# Altium schematic sheet Sheet02.SchDoc
size A4
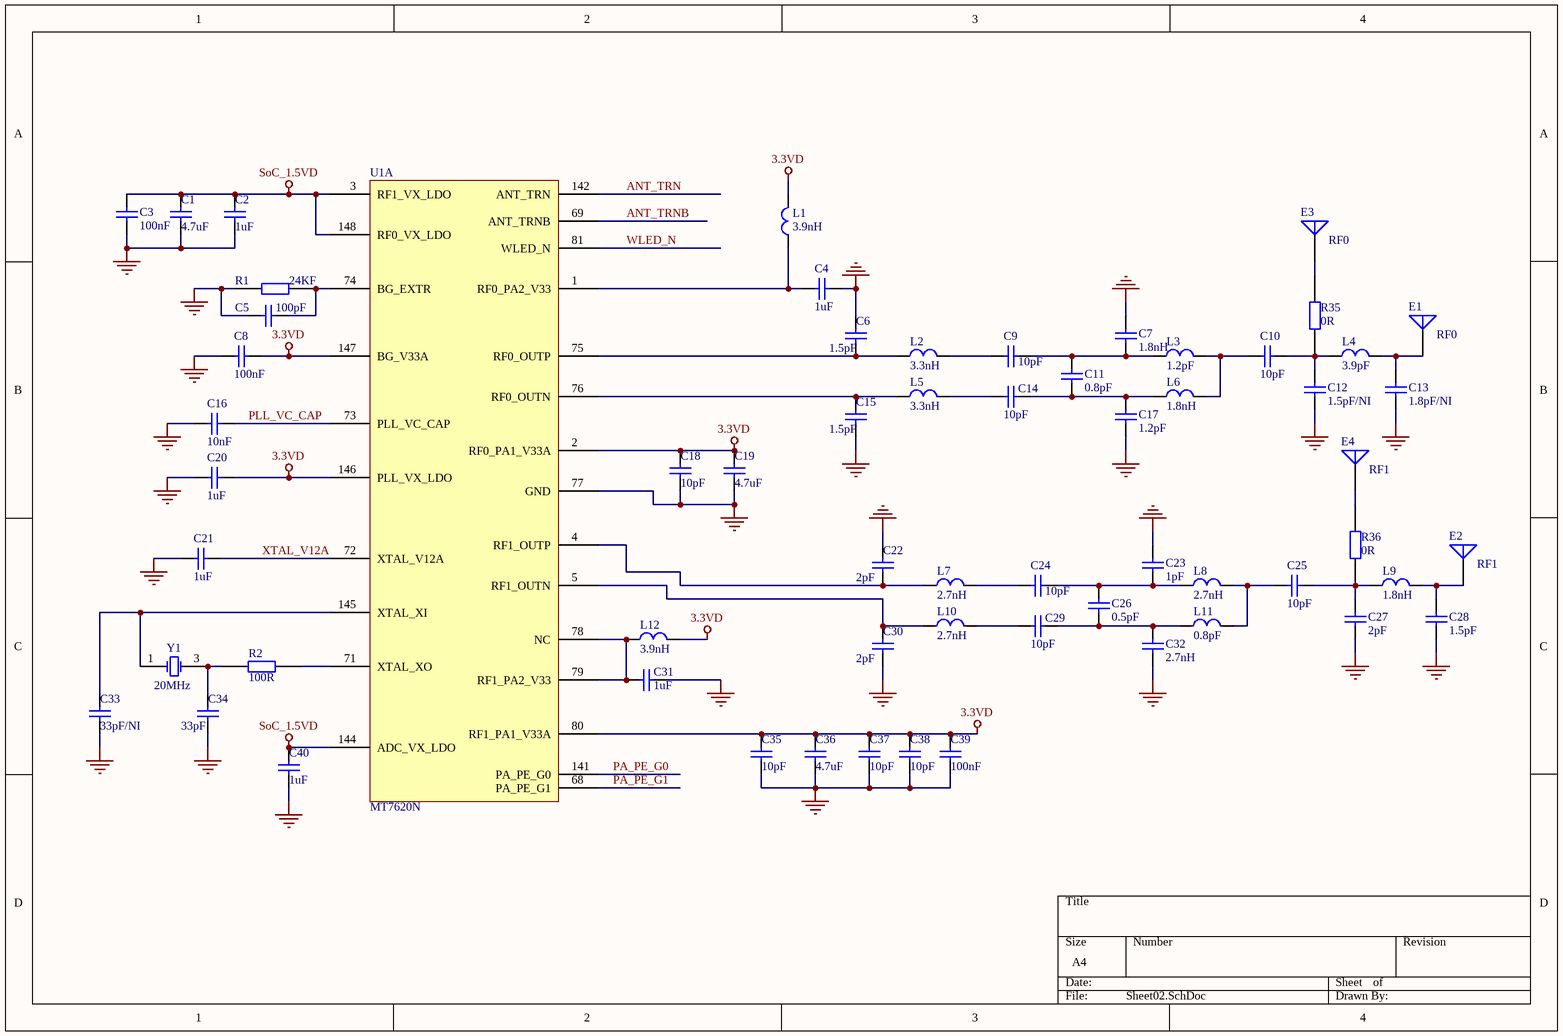
[diagram p0: Sheet02.SchDoc]

## Parts
C1  4.7uF  [R0603]
C2  1uF  [R0402]
C3  100nF  [R0402]
C4  1uF  [R0402]
C5  100pF  [R0402]
C6  1.5pF  [R0402]
C7  1.8nH  [R0402]
C8  100nF  [R0402]
C9  10pF  [R0402]
C10  10pF  [R0402]
C11  0.8pF  [R0402]
C12  1.5pF/NI  [R0402]
C13  1.8pF/NI  [R0402]
C14  10pF  [R0402]
C15  1.5pF  [R0402]
C16  10nF  [R0402]
C17  1.2pF  [R0402]
C18  10pF  [R0402]
C19  4.7uF  [R0603]
C20  1uF  [R0402]
C21  1uF  [R0402]
C22  2pF  [R0402]
C23  1pF  [R0402]
C24  10pF  [R0402]
C25  10pF  [R0402]
C26  0.5pF  [R0402]
C27  2pF  [R0402]
C28  1.5pF  [R0402]
C29  10pF  [R0402]
C30  2pF  [R0402]
C31  1uF  [R0402]
C32  2.7nH  [R0402]
C33  33pF/NI  [R0402]
C34  33pF  [R0402]
C35  10pF  [R0402]
C36  4.7uF  [R0603]
C37  10pF  [R0402]
C38  10pF  [R0402]
C39  100nF  [R0402]
C40  1uF  [R0402]
E1  RF0  [B_Ant]
E2  RF1  [B_Ant_B]
E3  RF0  [SMA_ANT_2]
E4  RF1  [SMA_ANT_2]
L1  3.9nH  [R0402]
L2  3.3nH  [R0402]
L3  1.2pF  [R0402]
L4  3.9pF  [R0402]
L5  3.3nH  [R0402]
L6  1.8nH  [R0402]
L7  2.7nH  [R0402]
L8  2.7nH  [R0402]
L9  1.8nH  [R0402]
L10  2.7nH  [R0402]
L11  0.8pF  [R0402]
L12  3.9nH  [R0402]
R1  24KF  [R0402]
R2  100R  [R0402]
R35  0R  [R0402]
R36  0R  [R0402]
U1  MT7620N  [QFN-148-RT]  (part A of 5)
Y1  20MHz  [SMD3225B]

## Nets
3.3VD: C8.1 C18.2 C19.2 C20.2 C35.2 C36.2 C37.2 C38.2 C39.2 L1.2 L12.2 U1.2(RF0_PA1_V33A) U1.80(RF1_PA1_V33A) U1.146(PLL_VX_LDO) U1.147(BG_V33A)
GND: C1.1 C2.1 C3.2 C4.2 C5.2 C6.2 C7.1 C8.2 C12.2 C13.2 C15.1 C16.2 C17.2 C18.1 C19.1 C20.1 C21.2 C22.2 C23.1 C27.2 C28.2 C30.1 C31.2 C32.2 C33.1 C34.1 C35.1 C36.1 C37.1 C38.1 C39.1 C40.1 R1.1 U1.77(GND) Y1.2(GND) Y1.4(GND)
SoC_1.5VD: C1.2 C2.2 C3.1 C40.2 U1.3(RF1_VX_LDO) U1.144(ADC_VX_LDO) U1.148(RF0_VX_LDO)
ANT_TRN: U1.142(ANT_TRN)
ANT_TRNB: U1.69(ANT_TRNB)
PA_PE_G0: U1.141(PA_PE_G0)
PA_PE_G1: U1.68(PA_PE_G1)
PLL_VC_CAP: C16.1 U1.73(PLL_VC_CAP)
WLED_N: U1.81(WLED_N)
XTAL_V12A: C21.1 U1.72(XTAL_V12A)
NetC4_1: C4.1 L1.1 U1.1(RF0_PA2_V33)
NetC5_1: C5.1 R1.2 U1.74(BG_EXTR)
NetC6_1: C6.1 L2.1 U1.75(RF0_OUTP)
NetC7_2: C7.2 C9.1 C11.1 L3.1
NetC9_2: C9.2 L2.2
NetC10_1: C10.1 L3.2 L6.2
NetC10_2: C10.2 C12.1 L4.1 R35.1
NetC11_2: C11.2 C14.1 C17.1 L6.1
NetC13_1: C13.1 E1.1(A) L4.2
NetC14_2: C14.2 L5.2
NetC15_2: C15.2 L5.1 U1.76(RF0_OUTN)
NetC22_1: C22.1 L7.1 U1.4(RF1_OUTP)
NetC23_2: C23.2 C24.1 C26.1 L8.1
NetC24_2: C24.2 L7.2
NetC25_1: C25.1 L8.2 L11.2
NetC25_2: C25.2 C27.1 L9.1 R36.1
NetC26_2: C26.2 C29.1 C32.1 L11.1
NetC28_1: C28.1 E2.1(A) L9.2
NetC29_2: C29.2 L10.2
NetC30_2: C30.2 L10.1 U1.5(RF1_OUTN)
NetC31_1: C31.1 L12.1 U1.78(NC) U1.79(RF1_PA2_V33)
NetC33_2: C33.2 U1.145(XTAL_XI) Y1.1(OSC1)
NetC34_2: C34.2 R2.1 Y1.3(OSC2)
NetE3_1: E3.1(A) R35.2
NetE4_1: E4.1(A) R36.2
NetR2_2: R2.2 U1.71(XTAL_XO)

## Library data of the parts
C1-C6 C8 C15 C16 C18-C22 C30 C31 C33-C39 = Cap Semi: 2pF, 50V, +/-0.25pF; Manufacturer: Generic Components; Class: Passive; SubClass: Capacitor; Value: 0.1uF; Published: 08/06/2000; Publisher: Altium Hobart Technology Centre
C7 C23 = Cap Semi: 1pF, 50V, +/-0.25pF; Manufacturer: Generic Components; Class: Passive; SubClass: Capacitor; Value: 0.1uF; Published: 08/06/2000; Publisher: Altium Hobart Technology Centre
C9 C14 C24 C29 = Cap Semi: 10pF, 50V, +/-0.25pF; Manufacturer: Generic Components; Class: Passive; SubClass: Capacitor; Value: 0.1uF; Published: 08/06/2000; Publisher: Altium Hobart Technology Centre
C10 C12 C13 C25 C27 C28 = Cap Semi: NI; Manufacturer: Generic Components; Class: Passive; SubClass: Capacitor; Value: 0.1uF; Published: 08/06/2000; Publisher: Altium Hobart Technology Centre
C11 C26 = Cap Semi: 0.5pF, 50V, +/-0.25pF; Manufacturer: Generic Components; Class: Passive; SubClass: Capacitor; Value: 0.1uF; Published: 08/06/2000; Publisher: Altium Hobart Technology Centre
C17 C32 C40 = Cap Semi: Manufacturer: Generic Components; Class: Passive; SubClass: Capacitor; Value: 0.1uF; Published: 08/06/2000; Publisher: Altium Hobart Technology Centre
E1-E4 = Antenna: Generic Antenna; Published: 24-Mar-1999; LatestRevisionDate: 17-Jul-2002; LatestRevisionNote: Re-released for DXP Platform.; PackageReference: PIN1; Publisher: Altium Limited
L1-L3 L5 L7 L8 L10 L12 = L_SMD: 3.9nH, +/-0.1nH
L4 L6 L9 L11 = L_SMD
R1 R2 R35 R36 = RES
Y1 = XTAL-4